# Altium project PCB_Project.PrjPcb
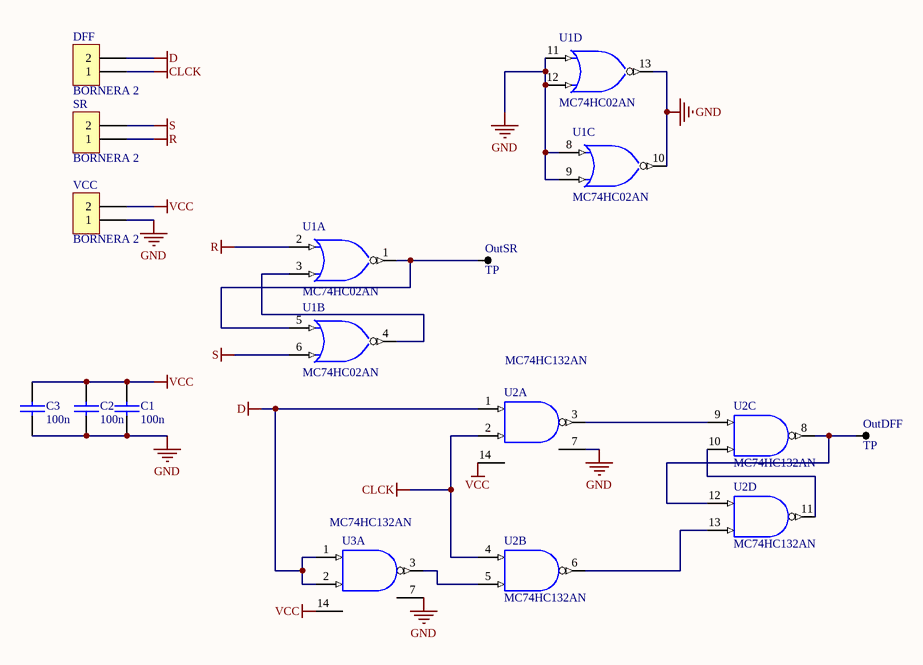
[diagram p0: Sheet1.SchDoc]
2 sheets, 16 parts. Net scope: global (net labels, ports and power ports of the same name join across sheets).
Board files: PCB1.PcbDoc, edgeDetector.PcbDoc
Sheets:
  Sheet1.SchDoc
  edgeDetector.SchDoc

## Sheet Sheet1.SchDoc
size A

### Parts
(Parts that share a designator on the sheet are numbered #1, #2 ... from top to bottom, then left to right.)
C1#1  100n  [0805]
C2  100n  [0805]
C3  100n  [0805]
DFF  BORNERA 2  [BORNERA2]
OutDFF  TP  [TPTH]
OutSR  TP  [TPTH]
SR  BORNERA 2  [BORNERA2]
U1  MC74HC02AN  [646-06]  (parts A,B,C,D of 4)
U2  MC74HC132AN  [646-06]  (parts A,B,C,D of 4)
U3  MC74HC132AN  [646-06]  (part A of 4)
VCC#1  BORNERA 2  [BORNERA2]

### Nets
CLCK: DFF.1 U2.2(B) U2.4(A)
D: DFF.2 U2.1(A) U3.1(A) U3.2(B)
GND: C1#1.2 C2.2 C3.2 U1.7(GND) U1.8(A) U1.9(B) U1.10(~{Y}) U1.11(A) U1.12(B) U1.13(~{Y}) U2.7(GND) U3.7(GND) VCC#1.1
R: SR.1 U1.2(A)
S: SR.2 U1.6(B)
VCC: C1#1.1 C2.1 C3.1 U1.14(VCC) U2.14(VDD) U3.14(VDD) VCC#1.2  [also labelled VDD]
NetOutDFF_1: OutDFF.1 U2.8(Y) U2.12(A)
NetOutSR_1: OutSR.1 U1.1(~{Y}) U1.5(A)
NetU1_3: U1.3(B) U1.4(~{Y})
NetU2_3: U2.3(Y) U2.9(A)
NetU2_5: U2.5(B) U3.3(Y)
NetU2_6: U2.6(Y) U2.13(B)
NetU2_10: U2.10(B) U2.11(Y)

### Library data of the parts
C1#1 C2 C3 = CAP
U1 = MC74HC02AN: Quad 2-Input NOR Gate; Published: 15-Apr-2002; DatasheetVersion: Mar-2000; PackageVersion: 1995; PackageReference: 646-06; Publisher: Altium Limited; PackageDescription: DIP; 14 Leads; Row Spacing 7.62 mm; Pitch 2.54 mm; ComponentLink1Description: Manufacturer Link; ComponentLink1URL: http://www.onsemi.com/; ComponentLink2Description: Datasheet; ComponentLink2URL: http://www.onsemi.com/pub/Collateral/MC74HC02A-D.PDF
U2 U3 = MC74HC132AN: Quad 2-Input NAND Gate with Schmitt Trigger Inputs; Published: 15-Apr-2002; DatasheetVersion: Mar-2000; PackageVersion: 1995; PackageReference: 646-06; Publisher: Altium Limited; PackageDescription: DIP; 14 Leads; Row Spacing 7.62 mm; Pitch 2.54 mm; ComponentLink1Description: Manufacturer Link; ComponentLink1URL: http://www.onsemi.com/; ComponentLink2Description: Datasheet; ComponentLink2URL: http://www.onsemi.com/pub/Collateral/MC74HC132A-D.PDF

## Sheet edgeDetector.SchDoc
size A
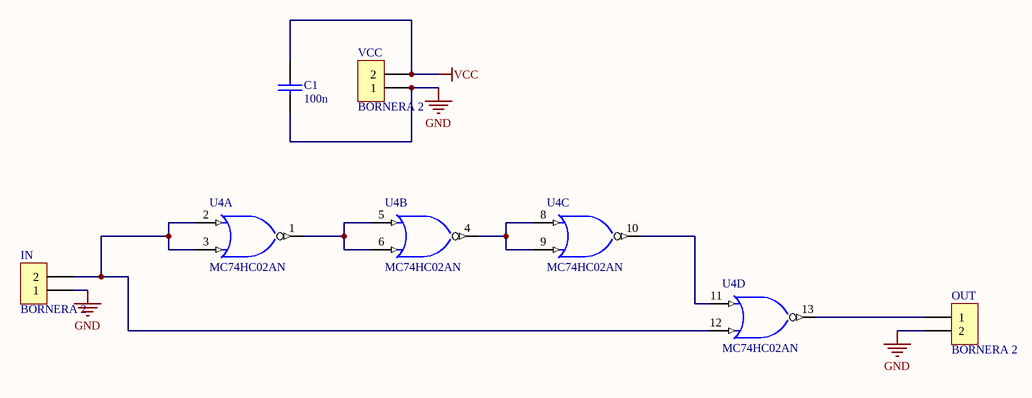
[diagram p1: edgeDetector.SchDoc]

### Parts
(Parts that share a designator on the sheet are numbered #1, #2 ... from top to bottom, then left to right.)
C1#2  100n  [0805]
IN  BORNERA 2  [BORNERA2]
OUT  BORNERA 2  [BORNERA2]
U4  MC74HC02AN  [646-06]  (parts A,B,C,D of 4)
VCC#2  BORNERA 2  [BORNERA2]

### Nets
GND: C1#2.2 IN.1 OUT.2 U4.7(GND) VCC#2.1
VCC: C1#2.1 U4.14(VCC) VCC#2.2
NetIN_2: IN.2 U4.2(A) U4.3(B) U4.12(B)
NetOUT_1: OUT.1 U4.13(~{Y})
NetU4_1: U4.1(~{Y}) U4.5(A) U4.6(B)
NetU4_4: U4.4(~{Y}) U4.8(A) U4.9(B)
NetU4_10: U4.10(~{Y}) U4.11(A)

### Library data of the parts
C1#2 = CAP
U4 = MC74HC02AN: Quad 2-Input NOR Gate; Published: 15-Apr-2002; DatasheetVersion: Mar-2000; PackageVersion: 1995; PackageReference: 646-06; Publisher: Altium Limited; PackageDescription: DIP; 14 Leads; Row Spacing 7.62 mm; Pitch 2.54 mm; ComponentLink1Description: Manufacturer Link; ComponentLink1URL: http://www.onsemi.com/; ComponentLink2Description: Datasheet; ComponentLink2URL: http://www.onsemi.com/pub/Collateral/MC74HC02A-D.PDF

## Nets that join several sheets
GND: Sheet1 (13 pins), edgeDetector (5 pins)
VCC: Sheet1 (7 pins), edgeDetector (C1#2.1 U4.14 VCC#2.2)